# Altium schematic sheet SX1276.SchDoc: STM32 LoRa Node
size A4; Author: Leon Baždar; CompanyName: FER; Address1: Zagreb; Revision: V1.0; SheetNumber: 6; SheetTotal: 6
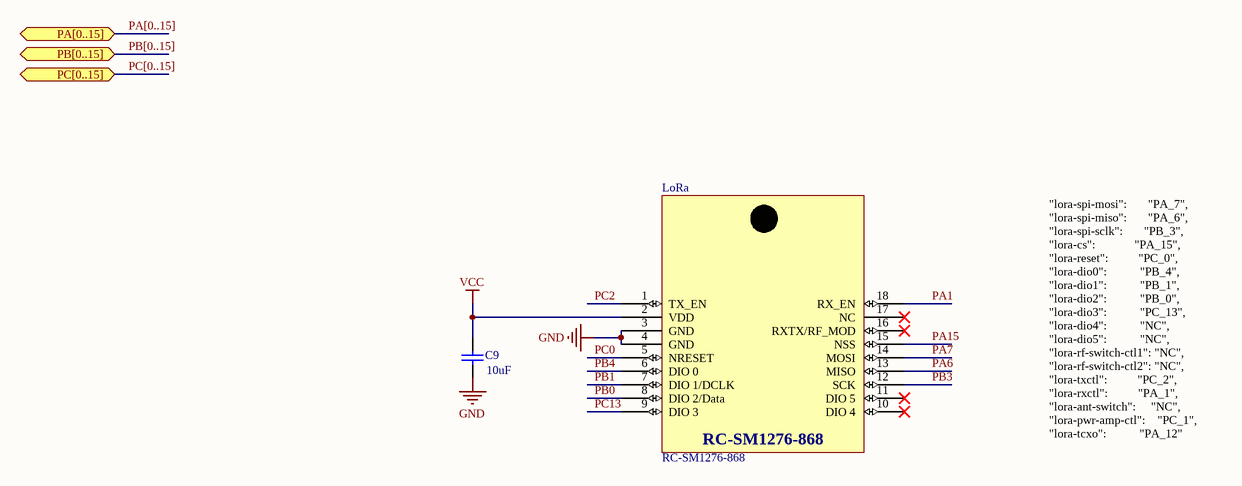
[diagram p0: SX1276.SchDoc]

## Parts
C9  10uF  [CAPC2013X145X20ML20]
LoRa  RC-SM1276-868  [RC-SM1276-868]

## Ports
PA[0..15] (bidir), PB[0..15] (bidir), PC[0..15] (bidir)

## Nets
GND: C9.1 LoRa.3(GND) LoRa.4(GND)
VCC: C9.2 LoRa.2(VDD)
PA1: LoRa.18(RX_EN)
PA6: LoRa.13(MISO)
PA7: LoRa.14(MOSI)
PA15: LoRa.15(NSS)
PB0: LoRa.8(DIO_2/Data)
PB1: LoRa.7(DIO_1/DCLK)
PB3: LoRa.12(SCK)
PB4: LoRa.6(DIO_0)
PC0: LoRa.5(NRESET)
PC2: LoRa.1(TX_EN)
PC13: LoRa.9(DIO_3)

Not connected (* = marked no-connect by the designer): LoRa 10(DIO_4)* 11(DIO_5)* 16(RXTX/RF_MOD)* 17(NC)*

## Buses and harness runs
bus PA[0..15] = port PA[0..15]
bus PB[0..15] = port PB[0..15]
bus PC[0..15] = port PC[0..15]

## Notes on the sheet
- "lora-spi-mosi":       "PA_7",
  "lora-spi-miso":       "PA_6",
  "lora-spi-sclk":       "PB_3",
  "lora-cs":             "PA_15",
  "lora-reset":          "PC_0",
  "lora-dio0":           "PB_4",
  "lora-dio1":           "PB_1",
  "lora-dio2":           "PB_0",
  "lora-dio3":           "PC_13",
  "lora-dio4":           "NC",
  "lora-dio5":           "NC",
  "lora-rf-switch-ctl1": "NC",
  "lora-rf-switch-ctl2": "NC",
  "lora-txctl":          "PC_2",
  "lora-rxctl":          "PA_1",
  "lora-ant-switch":     "NC",
  "lora-pwr-amp-ctl":    "PC_1",
  "lora-tcxo":           "PA_12"
- Project:
- File:
- Size:
- A4
- Author:
- Revision:
- Date:
- Sheet
- of

## Library data of the parts
C9 = CMP-2000-05452-1: Multilayer Ceramic Chip Capacitor, 10 uF, +/- 10%, 10 V, -55 to 125 degC, 0805 (2012 Metric), RoHS, Tape and Reel; Manufacturer: TDK; PCN Part Number: MLCCPartNumberChange30/Nov/2012; Capacitance: 10µF; Voltage - Rated: 10V; Product Training Modules: CSeriesGeneralApplicationsSEAT,CCV,andTVCLDesignToolsGuidetoReplacinganElectrolyticCapacitorwithanMLCC; Online Catalog: CSeries,GeneralPurpose; Other Names: 445-6857-6; Temperature Coefficient: X7R; Features: -; Ratings: -; Operating Temperature: -55degC~125degC; RoHS Information: RoHSCertificate-MLCC; Datasheet Version: Mar-15; Package / Case: 0805(2012Metric); Series: C; Mounting Type: SurfaceMount,MLCC; Family: CeramicCapacitors; Height - Seated (Max): -; Manufacturer URL: http://www.tdk.com/; Packaging: Digi-Reel; Tolerance: ±10%; Category: Capacitors; Applications: GeneralPurpose; Standard Package: 1; Size / Dimension: 0.079"Lx0.049"W(2.00mmx1.25mm); Datasheet URL: http://download.siliconexpert.com/pdfs/2015/4/21/15/54/45/779/tdk_/manual/37024850441143360mlcc_commercial_general_en.pdf; Lead Style: -; Lead Spacing: -; Thickness (Max): 0.057"(1.45mm); Package Reference: 805; Package Description: 2-Pin Surface Mount Device, Body 2 x 1.25 mm
LoRa = CMP-021-00007-1: https://www.radiocontrolli.com/it/componente/97/rc-sm1276-868; Min Supply Voltage: 1.8V; Max Supply Voltage: 3.7V; Pins: 18; Min Operating Temperature: -40°C; Max Operating Temperature: 85°C; Mounting Technology: SMT